# Altium schematic sheet VCU Schematic.SchDoc (part 2 of 2)
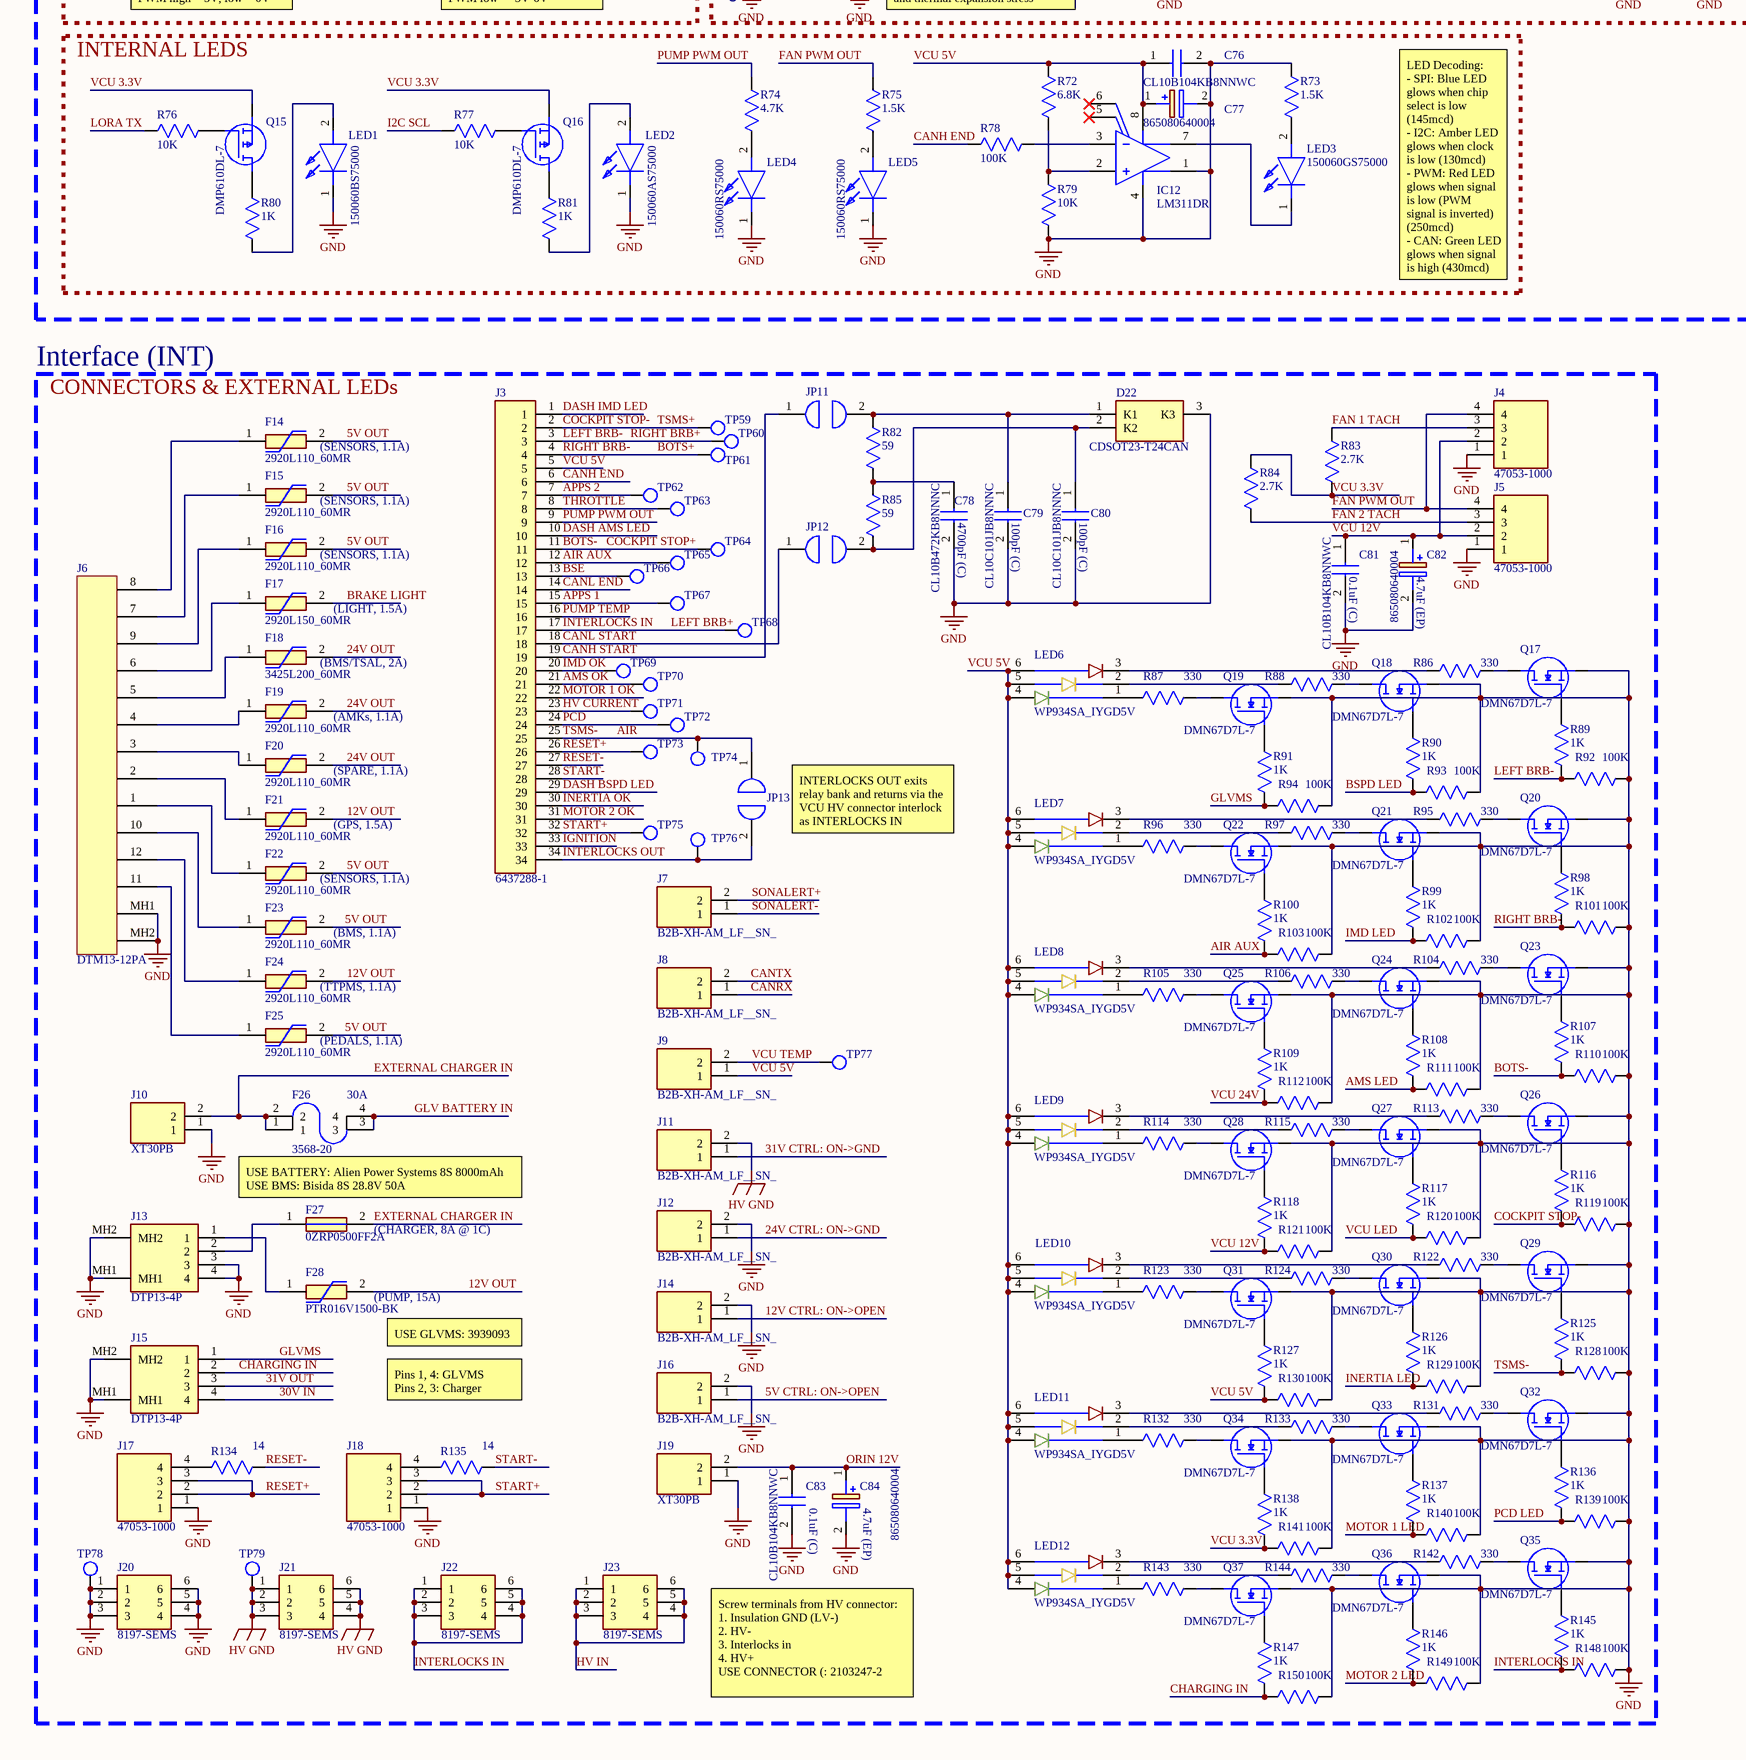
[diagram p4: VCU Schematic.SchDoc, bottom left]

## Library data of the parts
C1 = CMP-001-00214-2: Capacitor; Manufacturer_Name: KEMET; Source: SamacSys.SchLib; Height: 25.2mm; Mouser Part Number: 80-C4AQJLW5300M38J; Manufacturer_Part_Number: C4AQJLW5300M38J; Mouser Price/Stock: https://www.mouser.co.uk/ProductDetail/KEMET/C4AQJLW5300M38J?qs=81r%252BiQLm7BQPDIKgnvCGAA%3D%3D; Datasheet Link: https://content.kemet.com/datasheets/KEM_F3125_C4AQ_M.pdf; Design Item ID: C4AQJLW5300M38J
C2 C11 C19 C30 = CL31B105KCHNNNE: Capacitor; Manufacturer_Name: SAMSUNG; Datasheet Link: https://datasheet.datasheetarchive.com/originals/distributors/Datasheets-DGA8/2461474.pdf; Height: 1.8mm; Manufacturer_Part_Number: CL31B105KCHNNNE; Mouser Part Number: 187-CL31B105KCHNNNE; Mouser Price/Stock: https://www.mouser.co.uk/ProductDetail/Samsung-Electro-Mechanics/CL31B105KCHNNNE?qs=349EhDEZ59qH1i3RhF2lug%3D%3D; Arrow Part Number: CL31B105KCHNNNE; Arrow Price/Stock: https://www.arrow.com/en/products/cl31b105kchnnne/samsung-electro-mechanics?region=nac
C3 C12 C20 C31 = T83E106K063EZZL: Capacitor Polarised; Manufacturer_Name: Vishay; Datasheet Link: http://www.vishay.com/docs/40077/t83.pdf; Height: 4.3mm; Manufacturer_Part_Number: T83E106K063EZZL; Mouser Part Number: 74-T83E106K063EZZL; Mouser Price/Stock: https://www.mouser.co.uk/ProductDetail/Vishay-Sprague/T83E106K063EZZL?qs=bhRDl8yh5u2JAZRCy1HPEw%3D%3D
C4 C13 C21 C32 = ECA-2AM331B: Capacitor Polarised; Manufacturer_Name: Panasonic; Datasheet Link: http://industrial.panasonic.com/cdbs/www-data/pdf/RDF0000/ABA0000C1218.pdf; Height: 27mm; Manufacturer_Part_Number: ECA-2AM331B; Mouser Part Number: 667-ECA-2AM331B; Mouser Price/Stock: https://www.mouser.co.uk/ProductDetail/Panasonic/ECA-2AM331B?qs=rMMd5vBiahqjgMpL%2Fsd%2Fyw%3D%3D; Arrow Part Number: ECA-2AM331B; Arrow Price/Stock: https://www.arrow.com/en/products/eca-2am331b/panasonic?region=nac
C5-C9 = 2220Y1K00474KXTWS2: Capacitor; Manufacturer_Name: Knowles; Datasheet Link: https://www.arrow.com/en/products/2220y1k00474kxtws2/syfer-technology; Height: 4.2mm; Manufacturer_Part_Number: 2220Y1K00474KXTWS2; Mouser Part Number: 843-2220Y1K00474KXS2; Mouser Price/Stock: https://www.mouser.co.uk/ProductDetail/Knowles-Syfer/2220Y1K00474KXTWS2?qs=bSDeiJtCvhoXWXSepZiLyg%3D%3D; Arrow Part Number: 2220Y1K00474KXTWS2; Arrow Price/Stock: https://www.arrow.com/en/products/2220y1k00474kxtws2/syfer-technology
C10 C17 C18 C25 C26 C33 = GRM155R72A222KA01D: Capacitor; Manufacturer_Name: Murata Electronics; Datasheet Link: http://www.murata.com/~/media/webrenewal/support/library/catalog/products/capacitor/mlcc/c02e.pdf; Height: 0.55mm; Manufacturer_Part_Number: GRM155R72A222KA01D; Mouser Part Number: 81-GRM155R72A222KA1D; Mouser Price/Stock: https://www.mouser.co.uk/ProductDetail/Murata-Electronics/GRM155R72A222KA01D?qs=c4yvaafl%252BAyyueMyxdeLAg%3D%3D
C14 C22 C27 = CL32Y106KCVZNWE: Capacitor; Manufacturer_Name: SAMSUNG; Datasheet Link: https://media.digikey.com/pdf/Data%20Sheets/Samsung%20PDFs/CL32Y106KCVZNWE_Spec.pdf; Height: 2.8mm; Manufacturer_Part_Number: CL32Y106KCVZNWE; Mouser Part Number: 187-CL32Y106KCVZNWE; Mouser Price/Stock: https://www.mouser.co.uk/ProductDetail/Samsung-Electro-Mechanics/CL32Y106KCVZNWE?qs=Li%252BoUPsLEnvjCVdvDH8lMw%3D%3D; Arrow Part Number: CL32Y106KCVZNWE; Arrow Price/Stock: https://www.arrow.com/en/products/cl32y106kcvznwe/samsung-electro-mechanics?region=nac
C15 C23 C28 = CMP-001-00194-1: Capacitor Polarised; Manufacturer_Name: Panasonic; Mouser Part Number: 667-ECA-2AM471; Design Item ID: ECA-2AM471; Source: SamacSys.SchLib; Datasheet Link: http://industrial.panasonic.com/cdbs/www-data/pdf/RDF0000/ABA0000C1218.pdf; Arrow Part Number: ECA-2AM471; Height: 27mm; Mouser Price/Stock: https://www.mouser.co.uk/ProductDetail/Panasonic/ECA-2AM471?qs=ne66E0WZ%2FFnxnVbPF9YmTg%3D%3D; Arrow Price/Stock: https://www.arrow.com/en/products/eca-2am471/panasonic; Manufacturer_Part_Number: ECA-2AM471
C16 C24 C29 = 100PX1000MEFC18X35.5: Capacitor Polarised; Manufacturer_Name: Rubycon; Datasheet Link: https://datasheet.datasheetarchive.com/originals/distributors/Datasheets-DGA21/2010082.pdf; Height: 37.5mm; Manufacturer_Part_Number: 100PX1000MEFC18X35.5; Mouser Part Number: 232-PX1000MEFC18X355; Mouser Price/Stock: https://www.mouser.co.uk/ProductDetail/Rubycon/100PX1000MEFC18X355?qs=T3oQrply3y%2F7unL6a4BMVw%3D%3D
C34-C37 C39 C41 C42 C45-C48 C52 C54 C56-C58 C60 C64 C68 C70 C72 C74 C76 C81 C83 = CL10B104KB8NNWC: Capacitor; Manufacturer_Name: SAMSUNG; Datasheet Link: http://www.samsungsem.com/kr/support/product-search/mlcc/CL10B104KB8NNWC.jsp; Height: 0.9mm; Manufacturer_Part_Number: CL10B104KB8NNWC; Mouser Part Number: 187-CL10B104KB8NNWC; Mouser Price/Stock: https://www.mouser.co.uk/ProductDetail/Samsung-Electro-Mechanics/CL10B104KB8NNWC?qs=EvNa9vf1TdYOAZGBJN%252BGRQ%3D%3D; Arrow Part Number: CL10B104KB8NNWC; Arrow Price/Stock: https://www.arrow.com/en/products/cl10b104kb8nnwc/samsung-electro-mechanics?region=europe
C38 C40 C43 C44 C49 C51 C53 C55 C59 C61 C65 C69 C71 C73 C75 C77 C82 C84 = 865080640004: Capacitor Polarised; Manufacturer_Name: Wurth Elektronik; Datasheet Link: https://www.we-online.de/katalog/datasheet/865080640004.pdf; Height: 5.5mm; Manufacturer_Part_Number: 865080640004; Mouser Part Number: 710-865080640004; Mouser Price/Stock: https://www.mouser.co.uk/ProductDetail/Wurth-Elektronik/865080640004?qs=0KOYDY2FL2%2FjY4kqBxIvAg%3D%3D
C50 = A768KS107M1HLAE030: Capacitor Polarised; Manufacturer_Name: KEMET; Datasheet Link: https://content.kemet.com/datasheets/KEM_A4088_A768.pdf; Height: 12.5mm; Manufacturer_Part_Number: A768KS107M1HLAE030; Mouser Part Number: 80-A768KS107M1HLAE30; Mouser Price/Stock: https://www.mouser.co.uk/ProductDetail/KEMET/A768KS107M1HLAE030?qs=vmHwEFxEFR%2FC4eG3b93qRA%3D%3D; Arrow Part Number: A768KS107M1HLAE030; Arrow Price/Stock: https://www.arrow.com/en/products/a768ks107m1hlae030/kemet-corporation?region=nac
C62 C63 C67 C79 C80 = CL10C101JB8NNNC: Capacitor; Manufacturer_Name: SAMSUNG; Datasheet Link: https://lcsc.componentsearchengine.com/Datasheets/2/CL10C101JB8NNNC.pdf; Height: 0.9mm; Manufacturer_Part_Number: CL10C101JB8NNNC; Mouser Part Number: 187-CL10C101JB8NNNC; Mouser Price/Stock: https://www.mouser.co.uk/ProductDetail/Samsung-Electro-Mechanics/CL10C101JB8NNNC?qs=349EhDEZ59pXXooLigsK%2FQ%3D%3D; Arrow Part Number: CL10C101JB8NNNC; Arrow Price/Stock: https://www.arrow.com/en/products/cl10c101jb8nnnc/samsung-electro-mechanics?region=nac
C66 C78 = CL10B472KB8NNNC: Capacitor; Manufacturer_Name: SAMSUNG; Datasheet Link: https://datasheet.datasheetarchive.com/originals/distributors/Datasheets_SAMA/ace9b81a845c85bb1d3af59590a3c161.pdf; Height: 0.9mm; Manufacturer_Part_Number: CL10B472KB8NNNC; Mouser Part Number: 187-CL10B472KB8NNNC; Mouser Price/Stock: https://www.mouser.co.uk/ProductDetail/Samsung-Electro-Mechanics/CL10B472KB8NNNC?qs=349EhDEZ59pdLlcw1fwKyQ%3D%3D; Arrow Part Number: CL10B472KB8NNNC; Arrow Price/Stock: https://www.arrow.com/en/products/cl10b472kb8nnnc/samsung-electro-mechanics?region=nac
D1-D3 = 15KPA036C-SD-Q: TVS Diode (Bi-directional); Manufacturer_Name: Bourns; Datasheet Link: https://www.bourns.com/docs/Product-Datasheets/15KPA-SD-Q.pdf; Height: 5mm; Manufacturer_Part_Number: 15KPA036C-SD-Q; Mouser Part Number: 652-15KPA036C-SD-Q; Mouser Price/Stock: https://www.mouser.co.uk/ProductDetail/Bourns/15KPA036C-SD-Q?qs=BJlw7L4Cy7%252B8LnjuahAerQ%3D%3D; Arrow Part Number: 15KPA036C-SD-Q; Arrow Price/Stock: https://www.arrow.com/en/products/15kpa036c-sd-q/bourns?region=nac
D4 = 1SMB5926BT3G: Zener Diode; Manufacturer_Name: onsemi; Datasheet Link: http://www.onsemi.com/pub/Collateral/1SMB5913BT3-D.PDF; Height: 2.47mm; Manufacturer_Part_Number: 1SMB5926BT3G; Mouser Part Number: 863-1SMB5926BT3G; Mouser Price/Stock: https://www.mouser.co.uk/ProductDetail/onsemi/1SMB5926BT3G?qs=vLkC5FC1VN%252BB1lkMF78a0g%3D%3D; Arrow Part Number: 1SMB5926BT3G; Arrow Price/Stock: https://www.arrow.com/en/products/1smb5926bt3g/on-semiconductor?region=nac
D5 D9 = NSR0240V2T1G: Schottky Diode; Manufacturer_Name: onsemi; Datasheet Link: http://www.onsemi.com/pub/Collateral/NSR0240V2T1-D.PDF; Height: 0.7mm; Manufacturer_Part_Number: NSR0240V2T1G; Mouser Part Number: 863-NSR0240V2T1G; Mouser Price/Stock: https://www.mouser.co.uk/ProductDetail/onsemi/NSR0240V2T1G?qs=agb4oTp1Mj8VVVfs3jVB7Q%3D%3D; Arrow Part Number: NSR0240V2T1G; Arrow Price/Stock: https://www.arrow.com/en/products/nsr0240v2t1g/on-semiconductor?region=nac
D6 D10 D11 = VS-3C20ET07T-M3: Schottky Diode; Manufacturer_Name: Vishay; Datasheet Link: https://www.vishay.com/docs/97042/vs-3c20et07t-m3.pdf; Height: 4.65mm; Manufacturer_Part_Number: VS-3C20ET07T-M3; Mouser Part Number: 78-VS-3C20ET07T-M3; Mouser Price/Stock: https://www.mouser.co.uk/ProductDetail/Vishay-Semiconductors/VS-3C20ET07T-M3?qs=Y0Uzf4wQF3nb9gt0NYoZRQ%3D%3D
D7 D8 = NDSH20120C-F155: Schottky Diode; Manufacturer_Name: onsemi; Datasheet Link: https://www.onsemi.com/download/data-sheet/pdf/ndsh20120c-f155-d.pdf; Height: 4.82mm; Manufacturer_Part_Number: NDSH20120C-F155
D12-D20 = ACGRAT105L-HF: Diode; Manufacturer_Name: Comchip Technology; Datasheet Link: https://datasheet.datasheetarchive.com/originals/distributors/DKDS-12/228777.pdf; Height: 1.16mm; Manufacturer_Part_Number: ACGRAT105L-HF; Mouser Part Number: 750-ACGRAT105L-HF; Mouser Price/Stock: https://www.mouser.co.uk/ProductDetail/Comchip-Technology/ACGRAT105L-HF?qs=vdiGlTBG6JuOJVzqR%2F0B0g%3D%3D
D21 D22 = CDSOT23-T24CAN: TVS Diode (Bi-directional); Manufacturer_Name: Bourns; Datasheet Link: https://www.bourns.com/docs/Product-Datasheets/CDSOT23-T24CAN.pdf; Height: 1.17mm; Manufacturer_Part_Number: CDSOT23-T24CAN; Mouser Part Number: 652-CDSOT23-T24CAN; Mouser Price/Stock: https://www.mouser.co.uk/ProductDetail/Bourns/CDSOT23-T24CAN?qs=Z7P4xsdcg2LuAOb%2FzQ7xoQ%3D%3D; Arrow Part Number: CDSOT23-T24CAN; Arrow Price/Stock: https://www.arrow.com/en/products/cdsot23-t24can/bourns?region=nac
F1 = 03450101H: Undefined or Miscellaneous; Manufacturer_Name: LITTELFUSE; Datasheet Link: https://componentsearchengine.com/Datasheets/1/03450101H.pdf; Height: 12.192mm; Manufacturer_Part_Number: 03450101H; Mouser Part Number: 576-03450101H; Mouser Price/Stock: https://www.mouser.co.uk/ProductDetail/Littelfuse/03450101H?qs=gu7KAQ731UREbYiF7UHFpA%3D%3D; Arrow Part Number: 03450101H; Arrow Price/Stock: https://www.arrow.com/en/products/03450101h/littelfuse?region=nac
F2-F7 F26 = 3568-20: Undefined or Miscellaneous; Manufacturer_Name: Keystone Electronics; Datasheet Link: http://www.keystoneelectronics.net/ENG._DEPT/WEB_ORACLE/PDF/PDF%20CAT%20NO%20DRAWINGS/3000-3999/3568-20.PDF; Height: 7.5mm; Manufacturer_Part_Number: 3568-20; Mouser Part Number: 534-3568-20; Mouser Price/Stock: https://www.mouser.co.uk/ProductDetail/Keystone-Electronics/3568-20?qs=u16ybLDytRb5Cba9TKkDyQ%3D%3D
F8 F14-F16 F19-F25 = 2920L110_60MR: Fuse; Manufacturer_Name: LITTELFUSE; Manufacturer_Part_Number: 2920L110/60MR; Datasheet Link: http://m.littelfuse.com/~/media/electronics/datasheets/resettable_ptcs/littelfuse_ptc_2920l_datasheet.pdf.pdf; Height: 1.8mm; Mouser Part Number: 576-2920L110/60MR; Mouser Price/Stock: https://www.mouser.co.uk/ProductDetail/Littelfuse/2920L110-60MR?qs=lM4gFlnEeEN1ng8rp2hmTA%3D%3D; Arrow Part Number: 2920L110/60MR; Arrow Price/Stock: https://www.arrow.com/en/products/2920l11060mr/littelfuse?region=nac
F9 F13 = 1206L010_60: Resettable Fuse; Manufacturer_Name: LITTELFUSE; Manufacturer_Part_Number: 1206L010/60; Datasheet Link: https://www.littelfuse.com/~/media/electronics/datasheets/resettable_ptcs/littelfuse_ptc_1206l_datasheet.pdf.pdf; Height: 1.25mm
F10 = 2920L500_24SLDR: Resettable Fuse; Manufacturer_Name: LITTELFUSE; Manufacturer_Part_Number: 2920L500/24SLDR; Datasheet Link: https://www.mouser.fr/datasheet/2/240/littelfuse_ptc_low_rho_datasheet_pdf-1901322.pdf; Height: 1.2mm; Mouser Part Number: 576-2920L500/24SLDR; Mouser Price/Stock: https://www.mouser.co.uk/ProductDetail/Littelfuse/2920L500-24SLDR?qs=7MVldsJ5UawArZNHgYx0uA%3D%3D; Arrow Part Number: 2920L500/24SLDR; Arrow Price/Stock: https://www.arrow.com/en/products/2920l50024sldr/littelfuse?region=nac
F11 = 1812L020_60DR: Resettable Fuse; Manufacturer_Name: LITTELFUSE; Manufacturer_Part_Number: 1812L020/60DR; Datasheet Link: http://www.littelfuse.com/~/media/electronics/datasheets/resettable_ptcs/littelfuse_ptc_1812l_datasheet.pdf.pdf; Height: 1.25mm; Mouser Part Number: 576-1812L020/60DR; Mouser Price/Stock: https://www.mouser.co.uk/ProductDetail/Littelfuse/1812L020-60DR?qs=Co4VkB5J4%2FsPNArzeWNvjw%3D%3D; Arrow Part Number: 1812L020/60DR; Arrow Price/Stock: https://www.arrow.com/en/products/1812l02060dr/littelfuse?region=nac
F12 = 3425L260_60UR: Fuse; Manufacturer_Name: LITTELFUSE; Manufacturer_Part_Number: 3425L260/60UR; Datasheet Link: https://br.mouser.com/datasheet/2/240/Littelfuse_4_13_2023_PTC_3425L_Datasheet_prelimina-3168143.pdf; Height: 3mm; Mouser Part Number: 576-3425L260/60UR; Mouser Price/Stock: https://www.mouser.co.uk/ProductDetail/Littelfuse/3425L260-60UR?qs=Jm2GQyTW%2FbiRxpfTEkx6sQ%3D%3D
F17 = 2920L150_60MR: Fuse; Manufacturer_Name: LITTELFUSE; Manufacturer_Part_Number: 2920L150/60MR; Datasheet Link: https://www.littelfuse.com/media?resourcetype=datasheets&itemid=f237e8c2-1ed9-4c13-a738-dbe0738b3d2c&filename=2920l_datasheet_update.pdf; Height: 1.8mm; Mouser Part Number: 576-2920L150/60MR; Mouser Price/Stock: https://www.mouser.co.uk/ProductDetail/Littelfuse/2920L150-60MR?qs=ST9lo4GX8V38m%2FHq5uhZ8w%3D%3D
F18 = CMP-005-00135-1: Fuse; Manufacturer_Part_Number: 3425L200/60MR; Manufacturer_Name: LITTELFUSE; Mouser Price/Stock: https://www.mouser.co.uk/ProductDetail/Littelfuse/3425L200-60MR?qs=Jm2GQyTW%2Fbiqdph8lH2A%2FA%3D%3D; Mouser Part Number: 576-3425L200/60MR; Height: 1.8mm; Source: SamacSys.SchLib; Arrow Price/Stock: https://www.arrow.com/en/products/3425l20060mr/littelfuse?region=nac; Datasheet Link: https://www.littelfuse.com/media?resourcetype=datasheets&itemid=bc6d850b-99e2-4108-9141-9afcdeb5e383&filename=littelfuse-pptc-3425l-datasheet; Arrow Part Number: 3425L200/60MR; Design Item ID: 3425L200_60MR
F27 = 0ZRP0500FF2A: Fuse; Manufacturer_Name: Bel Circuit Protection; Datasheet Link: https://media.digikey.com/pdf/Data%20Sheets/Bel%20Fuse%20PDFs/0ZRP_Series.pdf; Height: 29mm; Manufacturer_Part_Number: 0ZRP0500FF2A; Arrow Part Number: 0ZRP0500FF2A; Arrow Price/Stock: https://www.arrow.com/en/products/0zrp0500ff2a/bel-group?region=nac
F28 = CMP-005-00021-2: Fuse; Manufacturer_Name: Eaton; Source: SamacSys.SchLib; Arrow Price/Stock: https://www.arrow.com/en/products/ptr016v1500-bk/eaton; Mouser Price/Stock: https://www.mouser.co.uk/ProductDetail/Bussmann-Eaton/PTR016V1500-BK?qs=Uw9nVbVM8mZWWh1UrAwXjg%3D%3D; Mouser Part Number: 504-PTR016V1500-BK; Datasheet Link: https://www.eaton.com/content/dam/eaton/products/electronic-components/resources/data-sheet/eaton-ptr016v-16-volt-dc-radial-leaded-polytron-ptc-data-sheet.pdf; Design Item ID: PTR016V1500-BK; Height: 32mm; Arrow Part Number: PTR016V1500-BK; Manufacturer_Part_Number: PTR016V1500-BK
FL1-FL4 = CMP-028-000023-2: 440 H @ 100 kHz 2 Line Common Mode Choke Through Hole 15A DCR 2.91mOhm; Manufacturer_Name: KEMET; Design Item ID: SCF19XV-150-1R3A006JV; Source: SamacSys.SchLib; Datasheet Link: https://www.kemet.com/specsheet/SCF19XV-150-1R3A006JV; Manufacturer_Part_Number: SCF19XV-150-1R3A006JV; Height: 27.5mm; Mouser Part Number: 80-SCF19XV1501R306JV; Mouser Price/Stock: https://www.mouser.co.uk/ProductDetail/KEMET/SCF19XV-150-1R3A006JV?qs=MyNHzdoqoQKJOWsi1inKmw%3D%3D
IC1-IC3 IC5 IC6 IC12 = LM311DR: Integrated Circuit; Manufacturer_Name: Texas Instruments; Datasheet Link: http://www.ti.com/lit/ds/symlink/lm311.pdf; Height: 1.75mm; Manufacturer_Part_Number: LM311DR; Mouser Part Number: 595-LM311DR; Mouser Price/Stock: https://www.mouser.co.uk/ProductDetail/Texas-Instruments/LM311DR?qs=afYny40WCj3HJbADB1OGHQ%3D%3D; Arrow Part Number: LM311DR; Arrow Price/Stock: https://www.arrow.com/en/products/lm311dr/texas-instruments?region=nac
IC4 = SN74LVC1G08DCKR: Integrated Circuit; Manufacturer_Name: Texas Instruments; Datasheet Link: http://www.ti.com/lit/gpn/sn74lvc1g08; Height: 1.1mm; Manufacturer_Part_Number: SN74LVC1G08DCKR; Mouser Part Number: 595-SN74LVC1G08DCKR; Mouser Price/Stock: https://www.mouser.co.uk/ProductDetail/Texas-Instruments/SN74LVC1G08DCKR?qs=sbcp%2F4gpy0%2F8FFQ%252BRQ5MTw%3D%3D; Arrow Part Number: SN74LVC1G08DCKR; Arrow Price/Stock: https://www.arrow.com/en/products/sn74lvc1g08dckr/texas-instruments?region=nac
IC7 = LM338T_NOPB: Integrated Circuit; Manufacturer_Name: Texas Instruments; Manufacturer_Part_Number: LM338T/NOPB; Datasheet Link: http://www.ti.com/lit/ds/symlink/lm338.pdf; Height: 4.7mm; Mouser Part Number: 926-LM338T/NOPB; Mouser Price/Stock: https://www.mouser.co.uk/ProductDetail/Texas-Instruments/LM338T-NOPB?qs=X1J7HmVL2ZENaH7%2FMvkSlw%3D%3D; Arrow Part Number: LM338T/NOPB; Arrow Price/Stock: https://www.arrow.com/en/products/lm338tnopb/texas-instruments?region=nac
IC8 = SN65HVD230DR: Integrated Circuit; Manufacturer_Name: Texas Instruments; Datasheet Link: http://www.ti.com/lit/gpn/sn65hvd230; Height: 1.75mm; Manufacturer_Part_Number: SN65HVD230DR; Mouser Part Number: 595-SN65HVD230DR; Mouser Price/Stock: https://www.mouser.co.uk/ProductDetail/Texas-Instruments/SN65HVD230DR?qs=QViXGNcIEAtifeQR3pYVUQ%3D%3D; Arrow Part Number: SN65HVD230DR; Arrow Price/Stock: https://www.arrow.com/en/products/sn65hvd230dr/texas-instruments?region=nac
IC9 = ADC128D818CIMT_NOPB: Integrated Circuit; Manufacturer_Name: Texas Instruments; Manufacturer_Part_Number: ADC128D818CIMT/NOPB; Datasheet Link: http://www.ti.com/lit/ds/symlink/adc128d818.pdf; Height: 1.2mm; Mouser Part Number: 926-AD128D818CIMTNPB; Mouser Price/Stock: https://www.mouser.co.uk/ProductDetail/Texas-Instruments/ADC128D818CIMT-NOPB?qs=7X5t%252BdzoRHBmS0IUm5WMmA%3D%3D; Arrow Part Number: ADC128D818CIMT/NOPB; Arrow Price/Stock: https://www.arrow.com/en/products/adc128d818cimtnopb/texas-instruments?region=nac
IC10 = MIC5504-1.8YM5-TR: Integrated Circuit; Manufacturer_Name: Microchip; Datasheet Link: http://www.microchip.com/mymicrochip/filehandler.aspx?ddocname=en580292; Height: 1.45mm; Manufacturer_Part_Number: MIC5504-1.8YM5-TR; Mouser Part Number: 998-MIC5504-1.8YM5TR; Mouser Price/Stock: https://www.mouser.co.uk/ProductDetail/Microchip-Technology/MIC5504-1.8YM5-TR?qs=U6T8BxXiZAWcKt0MaB%252BQvA%3D%3D; Arrow Part Number: MIC5504-1.8YM5-TR; Arrow Price/Stock: https://www.arrow.com/en/products/mic5504-1.8ym5-tr/microchip-technology?region=nac
IC11 = LM4140CCMX-2.5_NOPB: Integrated Circuit; Manufacturer_Name: Texas Instruments; Manufacturer_Part_Number: LM4140CCMX-2.5/NOPB; Datasheet Link: http://www.ti.com/lit/gpn/LM4140; Height: 1.75mm; Mouser Part Number: 926-LM4140CCMX25NOPB; Mouser Price/Stock: https://www.mouser.co.uk/ProductDetail/Texas-Instruments/LM4140CCMX-2.5-NOPB?qs=QbsRYf82W3GtqMZqSvjzSA%3D%3D; Arrow Part Number: LM4140CCMX-2.5/NOPB; Arrow Price/Stock: https://www.arrow.com/en/products/lm4140ccmx-2.5nopb/texas-instruments?region=nac
J1 J2 = S1811-46R: Connector; Manufacturer_Name: Harwin; Datasheet Link: https://cdn.harwin.com/pdfs/S1811-46R.pdf; Height: 3.57mm; Manufacturer_Part_Number: S1811-46R; Mouser Part Number: 855-S1811-46R; Mouser Price/Stock: https://www.mouser.co.uk/ProductDetail/Harwin/S1811-46R?qs=63Lh8XYXgjtW3ZtUxZ2b3Q%3D%3D
J3 = 6437288-1: Connector; Manufacturer_Name: TE Connectivity; Datasheet Link: http://www.te.com/commerce/DocumentDelivery/DDEController?Action=srchrtrv&DocNm=6437288-1&DocType=Customer+Drawing&DocLang=Japanese; Manufacturer_Part_Number: 6437288-1; Mouser Part Number: 571-6437288-1; Mouser Price/Stock: https://www.mouser.co.uk/ProductDetail/TE-Connectivity/6437288-1?qs=WBj8811fzwGYtKR8aBSJZw%3D%3D; Arrow Part Number: 6437288-1; Arrow Price/Stock: https://www.arrow.com/en/products/6437288-1/te-connectivity?region=nac
J4 J5 J17 J18 = 47053-1000: Connector; Manufacturer_Name: Molex; Datasheet Link: http://www.molex.com/pdm_docs/sd/470531000_sd.pdf; Height: 8mm; Manufacturer_Part_Number: 47053-1000; Mouser Part Number: 538-47053-1000; Mouser Price/Stock: https://www.mouser.co.uk/ProductDetail/Molex/47053-1000?qs=ph4zPCVRuvqoDX7hrEhxNA%3D%3D
J6 = CMP-002-00082-6: Connector Header Panel Mount, Through Hole, Right Angle 12 position
J7-J9 J11 J12 J14 J16 = B2B-XH-AM_LF__SN_: Connector; Manufacturer_Name: JST (JAPAN SOLDERLESS TERMINALS); Manufacturer_Part_Number: B2B-XH-AM(LF)(SN); Datasheet Link: https://www.jst-mfg.com/product/pdf/eng/eXH.pdf; Height: 7mm; Arrow Part Number: B2B-XH-AM(LF)(SN); Arrow Price/Stock: https://www.arrow.com/en/products/b2b-xh-am-lf-sn/jst-manufacturing?region=europe
J10 J19 = XT30PB: Connector; Manufacturer_Name: Amass; Datasheet Link: https://www.tme.eu/Document/4acc913878197f8c2e30d4b8cdc47230/XT30UPB%20SPEC.pdf; Height: 10.7mm; Manufacturer_Part_Number: XT30PB
J13 J15 = CMP-007-000087-3: Automotive Connectors 90'PCB RECP; Manufacturer_Name: TE Connectivity; Mouser Price/Stock: https://www.mouser.co.uk/ProductDetail/TE-Connectivity-DEUTSCH/DTP13-4P?qs=AwlF29RKMWVhYNapzkCQIw%3D%3D; Arrow Price/Stock: https://www.arrow.com/en/products/dtp13-4p/te-connectivity?region=nac; Source: SamacSys.SchLib; Design Item ID: DTP13-4P; Datasheet Link: https://componentsearchengine.com/Datasheets/1/DTP13-4P.pdf; Arrow Part Number: DTP13-4P; Manufacturer_Part_Number: DTP13-4P; Height: 36.5mm; Mouser Part Number: 571-DTP13-4P
J20-J23 = 8197-SEMS: Connector; Manufacturer_Name: Keystone Electronics; Datasheet Link: http://www.keyelco.com/product-pdf.cfm?p=1541; Height: 6.35mm; Manufacturer_Part_Number: 8197-SEMS; Mouser Part Number: 534-8197-SEMS; Mouser Price/Stock: https://www.mouser.co.uk/ProductDetail/Keystone-Electronics/8197-SEMS?qs=LDXARy4xNQv%252BxMwBelqsBg%3D%3D
JP1-JP13 = TD-101-G-A: Connector; Manufacturer_Name: SAMTEC; Manufacturer_Part_Number: TD-101-G-A; Mouser Part Number: 200-TD101GA; Mouser Price/Stock: https://www.mouser.co.uk/ProductDetail/Samtec/TD-101-G-A?qs=%252BZP6%2F%252BtExtAjQbVAHD15gg%3D%3D
K1-K7 K? = CMP-007-000238-3: Low Profile Power Relay with 15.7 mm height; Manufacturer_Name: Omron Electronics; Manufacturer_Part_Number: G2RL2DC24; Arrow Price/Stock: https://www.arrow.com/en/products/g2rl2dc24/omron; Source: SamacSys.SchLib; Datasheet Link: https://omronfs.omron.com/en_US/ecb/products/pdf/en-g2rl.pdf; Arrow Part Number: G2RL2DC24; Height: 15.7mm; Design Item ID: G2RL2DC24
L1-L4 = PCM120T-100M-D: Inductor; Manufacturer_Name: TDK; Datasheet Link: https://product.tdk.com/system/files/dam/doc/product/inductor/inductor/smd/data_sheet/30/ds/pcm120t.pdf; Height: 11.5mm; Manufacturer_Part_Number: PCM120T-100M-D
LED1 = 150060BS75000: LED; Manufacturer_Name: Wurth Elektronik; Datasheet Link: https://componentsearchengine.com/Datasheets/2/150060BS75000.pdf; Height: 0.8mm; Manufacturer_Part_Number: 150060BS75000; Mouser Part Number: 710-150060BS75000; Mouser Price/Stock: https://www.mouser.co.uk/ProductDetail/Wurth-Elektronik/150060BS75000?qs=LlUlMxKIyB2DLLpXQThavA%3D%3D
LED2 = 150060AS75000: LED; Manufacturer_Name: Wurth Elektronik; Datasheet Link: https://componentsearchengine.com/Datasheets/2/150060AS75000.pdf; Height: 0.8mm; Manufacturer_Part_Number: 150060AS75000; Mouser Part Number: 710-150060AS75000; Mouser Price/Stock: https://www.mouser.co.uk/ProductDetail/Wurth-Elektronik/150060AS75000?qs=d0WKAl%252BL4KbvMBYryeof0Q%3D%3D
LED3 = 150060GS75000: LED; Manufacturer_Name: Wurth Elektronik; Datasheet Link: https://componentsearchengine.com/Datasheets/2/150060GS75000.pdf; Height: 0.8mm; Manufacturer_Part_Number: 150060GS75000; Mouser Part Number: 710-150060GS75000; Mouser Price/Stock: https://www.mouser.co.uk/ProductDetail/Wurth-Elektronik/150060GS75000?qs=LlUlMxKIyB0UYkq5lDO8nA%3D%3D
LED4 LED5 = 150060RS75000: LED; Manufacturer_Name: Wurth Elektronik; Datasheet Link: http://katalog.we-online.de/led/datasheet/150060RS75000.pdf; Height: 0.8mm; Manufacturer_Part_Number: 150060RS75000; Mouser Part Number: 710-150060RS75000; Mouser Price/Stock: https://www.mouser.co.uk/ProductDetail/Wurth-Elektronik/150060RS75000?qs=LlUlMxKIyB3QnmZ3fw%2FVCA%3D%3D
LED6-LED12 = WP934SA_IYGD5V: LED; Manufacturer_Name: Kingbright; Manufacturer_Part_Number: WP934SA/IYGD5V; Datasheet Link: https://www.mouser.com/datasheet/2/216/WP934SA-IYGD5V-932694.pdf; Height: 15.49mm; Mouser Part Number: 604-WP934SAIYGD5V; Mouser Price/Stock: https://www.mouser.co.uk/ProductDetail/Kingbright/WP934SA-IYGD5V?qs=2BHDEVAKmrX64UZLeVhMcw%3D%3D
MOV1 = V480SM7: Varistor; Manufacturer_Name: LITTELFUSE; Datasheet Link: https://www.littelfuse.com/~/media/electronics/datasheets/varistors/littelfuse_varistor_sm7_datasheet.pdf.pdf; Height: 6.3mm; Manufacturer_Part_Number: V480SM7; Mouser Part Number: 576-V480SM7; Mouser Price/Stock: https://www.mouser.co.uk/ProductDetail/Littelfuse/V480SM7?qs=tQeA2zcAjvWy%252BsU3ZBxm2Q%3D%3D; Arrow Part Number: V480SM7; Arrow Price/Stock: https://www.arrow.com/en/products/v480sm7/littelfuse
PS1 = CMP-026-000002-1: 1000W DC/DC converter in Half Brick format 31VDC; Manufacturer_Name: RECOM Power; Design Item ID: REC300H-2415SW; Datasheet Link: https://recom-power.com/pdf/Powerline_DC-DC/REC300H-W.pdf; Source: SamacSys.SchLib; Mouser Price/Stock: https://www.mouser.co.uk/ProductDetail/RECOM-Power/REC300H-2415SW?qs=T%252BzbugeAwjhRvDvMwGBQYQ%3D%3D; Height: 13.2mm; Manufacturer_Part_Number: REC300H-2415SW; Mouser Part Number: 919-REC300H-2415SW
PS2 = CMP-026-000000-2: DC DC CONVERTER 24V 401W; Manufacturer_Name: Cincon; Height: 13.2mm; Design Item ID: CFB400W-24S24; Source: SamacSys.SchLib; Manufacturer_Part_Number: CFB400W-24S24; Datasheet Link: https://www.cincon.com/productdownload/CFB400W-V12.pdf
PS3 = CMP-026-000001-3: 300W DC/DC converter in Half Brick format 15VDC; Manufacturer_Name: RECOM Power; Mouser Price/Stock: https://www.mouser.co.uk/ProductDetail/RECOM-Power/REC300H-2415SW?qs=T%252BzbugeAwjhRvDvMwGBQYQ%3D%3D; Manufacturer_Part_Number: REC300H-2415SW; Source: SamacSys.SchLib; Mouser Part Number: 919-REC300H-2415SW; Height: 13.2mm; Datasheet Link: https://recom-power.com/pdf/Powerline_DC-DC/REC300H-W.pdf; Design Item ID: REC300H-2415SW
PS4 = CMP-00001-4: Isolated DC/DC Converters - Through Hole DC-DC Converter; Manufacturer_Name: Cincon; Mouser Price/Stock: https://www.mouser.co.uk/ProductDetail/Cincon/CQB150W-24S05?qs=gt1LBUVyoHnJJoNfxuirUA%3D%3D; Mouser Part Number: 418-CQB150W24S05; Design Item ID: CQB150W-24S05; Source: SamacSys.SchLib; Datasheet Link: https://www.cincon.com/productdownload/Datasheet-CQB150W-series.pdf; Height: 13.2mm; Manufacturer_Part_Number: CQB150W-24S05
Q1 Q3 Q4 = IRF4905PBF: MOSFET (P-Channel); Manufacturer_Name: Infineon; Datasheet Link: https://datasheet.datasheetarchive.com/originals/distributors/Datasheets_SAMA/e52aa5f51fe2980ce3912b85b4d53dd4.pdf; Height: 4.69mm; Manufacturer_Part_Number: IRF4905PBF; Mouser Part Number: 942-IRF4905PBF; Mouser Price/Stock: https://www.mouser.co.uk/ProductDetail/Infineon-Technologies/IRF4905PBF?qs=9%252BKlkBgLFf39l0HsWdxvdw%3D%3D; Arrow Part Number: IRF4905PBF; Arrow Price/Stock: https://www.arrow.com/en/products/irf4905pbf/infineon-technologies-ag?region=europe
Q2 = 2SA1943N_S1,E,S_: Transistor BJT PNP; Manufacturer_Name: Toshiba; Manufacturer_Part_Number: 2SA1943N(S1,E,S); Datasheet Link: http://uk.rs-online.com/web/p/products/8902620; Height: 4.7mm; Mouser Part Number: 757-2SA1943N(S1ES); Mouser Price/Stock: https://www.mouser.co.uk/ProductDetail/Toshiba/2SA1943NS1ES?qs=2kOmHSv6VfRtRzKZ4N0o4Q%3D%3D; Arrow Part Number: 2SA1943N(S1,E,S); Arrow Price/Stock: https://www.arrow.com/en/products/2sa1943n-s1es/toshiba?region=nac
Q5-Q8 Q10 Q13 Q14 Q17-Q37 = DMN67D7L-7: MOSFET (N-Channel); Manufacturer_Name: Diodes Incorporated; Datasheet Link: https://componentsearchengine.com/Datasheets/1/DMN67D7L-7.pdf; Height: 1.1mm; Manufacturer_Part_Number: DMN67D7L-7; Mouser Part Number: 621-DMN67D7L-7; Mouser Price/Stock: https://www.mouser.co.uk/ProductDetail/Diodes-Incorporated/DMN67D7L-7?qs=W0yvOO0ixfEtOtSMB8B7pA%3D%3D; Arrow Part Number: DMN67D7L-7; Arrow Price/Stock: https://www.arrow.com/en/products/dmn67d7l-7/diodes-incorporated?region=nac
Q9 = CMP-031-00100-2: 60V P-CHANNEL ENHANCEMENT MODE MOSFET; Manufacturer_Name: Diodes Incorporated; Mouser Price/Stock: https://www.mouser.co.uk/ProductDetail/Diodes-Incorporated/DMP6185SE-13?qs=4EhzHfbM1GgQowXiZMrILA%3D%3D; Manufacturer_Part_Number: DMP6185SE-13; Mouser Part Number: 621-DMP6185SE-13; Source: SamacSys.SchLib; Datasheet Link: https://www.diodes.com/assets/Datasheets/DMP6185SE.pdf; Design Item ID: DMP6185SE-13; Height: 1.8mm
Q11 Q12 Q15 Q16 = CMP-007-000210-2: MOSFET MOSFET BVDSS: 41V-60V; Manufacturer_Name: Diodes Incorporated; Mouser Price/Stock: https://www.mouser.co.uk/ProductDetail/Diodes-Incorporated/DMP610DL-7?qs=W0yvOO0ixfG00Ba5A4lilA%3D%3D; Manufacturer_Part_Number: DMP610DL-7; Source: SamacSys.SchLib; Arrow Price/Stock: https://www.arrow.com/en/products/dmp610dl-7/diodes-incorporated?region=europe; Mouser Part Number: 621-DMP610DL-7; Arrow Part Number: DMP610DL-7; Height: 1.1mm; Design Item ID: DMP610DL-7; Datasheet Link: https://www.diodes.com/assets/Datasheets/DMP610DL.pdf
R1-R10 R12-R40 R42-R150 = CR1206-F_-2R00ELF: Resistor; Manufacturer_Name: Bourns; Manufacturer_Part_Number: CR1206-F/-2R00ELF; Height: 0.75mm; Mouser Part Number: 652-CR1206-F/2R00ELF; Mouser Price/Stock: https://www.mouser.co.uk/ProductDetail/Bourns/CR1206-F-2R00ELF?qs=W%2FMpXkg%252BdQ47Z%2FeZv1nDSg%3D%3D
R11 = SMW5R051JT: Resistor; Manufacturer_Name: TE Connectivity; Datasheet Link: http://docs-europe.electrocomponents.com/webdocs/087d/0900766b8087d7f5.pdf; Height: 7.1mm; Manufacturer_Part_Number: SMW5R051JT; Mouser Part Number: 279-SMW5R051JT; Mouser Price/Stock: https://www.mouser.co.uk/ProductDetail/TE-Connectivity-Holsworthy/SMW5R051JT?qs=8G8kQhBkhGga872gAAdmZg%3D%3D
R41 = SMW51R0JT: Resistor; Manufacturer_Name: TE Connectivity; Datasheet Link: http://docs-europe.electrocomponents.com/webdocs/087d/0900766b8087d7f5.pdf; Height: 7.1mm; Manufacturer_Part_Number: SMW51R0JT; Mouser Part Number: 571-SMW51R0JT; Mouser Price/Stock: https://www.mouser.co.uk/ProductDetail/TE-Connectivity-CGS/SMW51R0JT?qs=qLl%252Bu6Y%2FBlKH4yfSdThc6g%3D%3D; Arrow Part Number: SMW51R0JT; Arrow Price/Stock: https://www.arrow.com/en/products/smw51r0jt/te-connectivity
RV1-RV3 RV5 = PV36W103C01B00: Resistor; Manufacturer_Name: Bourns; Datasheet Link: http://www.bourns.com/docs/Product-Datasheets/pv36.pdf; Height: 10.03mm; Manufacturer_Part_Number: PV36W103C01B00; Mouser Part Number: 81-PV36W103C01B00; Mouser Price/Stock: https://www.mouser.co.uk/ProductDetail/Bourns/PV36W103C01B00?qs=XtBVvwDtlv0YnSNxZ%2FUOnw%3D%3D; Arrow Part Number: PV36W103C01B00; Arrow Price/Stock: https://www.arrow.com/en/products/pv36w103c01b00/bourns?region=nac
RV4 = CMP-009-00251-2: Bourns PV36W Series 25-Turn Through Hole Trimmer Resistor with Solder Pin Terminations; Datasheet Link: https://www.arrow.com/en/products/pv36w105c01b00/bourns?region=nac; Manufacturer_Part_Number: PV36W105C01B00; Mouser Price/Stock: https://www.mouser.co.uk/ProductDetail/Bourns/PV36W105C01B00?qs=ifmdR88tEJ8PzfHzcsxQTA%3D%3D; Mouser Part Number: 81-PV36W105C01B00; Arrow Price/Stock: https://www.arrow.com/en/products/pv36w105c01b00/bourns?region=nac; Height: 11.55mm; Design Item ID: PV36W105C01B00; Source: SamacSys.SchLib; Manufacturer_Name: Bourns; Arrow Part Number: PV36W105C01B00
S1-S3 = CMP-007-000261-2: DIP Switches / SIP Switches WS-DITV DIP 1p THT 2.54mm Hrztl Box; Manufacturer_Name: Wurth Elektronik; Manufacturer_Part_Number: 418117270901; Design Item ID: 418117270901; Mouser Price/Stock: https://www.mouser.co.uk/ProductDetail/Wurth-Elektronik/418117270901?qs=wr8lucFkNMXoidz%252BMVxNfg%3D%3D; Height: 5mm; Source: SamacSys.SchLib; Mouser Part Number: 710-418117270901; Datasheet Link: http://katalog.we-online.de/em/datasheet/418117270901.pdf
TP1-TP79 = CMP-034-000000-2: Test Point; Manufacturer_Name: Keystone Electronics; Arrow Part Number: 5010; Source: SamacSys.SchLib; Arrow Price/Stock: https://www.arrow.com/en/products/5010/keystone-electronics?region=europe; Mouser Price/Stock: https://www.mouser.co.uk/ProductDetail/Keystone-Electronics/5010?qs=qOqV1E1P08SzD%252BWfk1wMXQ%3D%3D; Height: 8.28mm; Design Item ID: 5010; Mouser Part Number: 534-5010; Manufacturer_Part_Number: 5010; Datasheet Link: http://www.farnell.com/datasheets/1703983.pdf
U1 U2 = PRT-14017: Connector; Manufacturer_Name: SparkFun; Datasheet Link: https://componentsearchengine.com/Datasheets/1/PRT-14017.pdf; Height: 13.75mm; Manufacturer_Part_Number: PRT-14017; Mouser Part Number: 474-PRT-14017; Mouser Price/Stock: https://www.mouser.co.uk/ProductDetail/SparkFun/PRT-14017?qs=a4BXICGgSn%2F%252BaML822b65A%3D%3D; Arrow Part Number: PRT-14017; Arrow Price/Stock: https://www.arrow.com/en/products/prt-14017/sparkfun-electronics?region=nac
U3 = CMP-016-00011-2: NVIDIA Jetson Nano Developer Kit